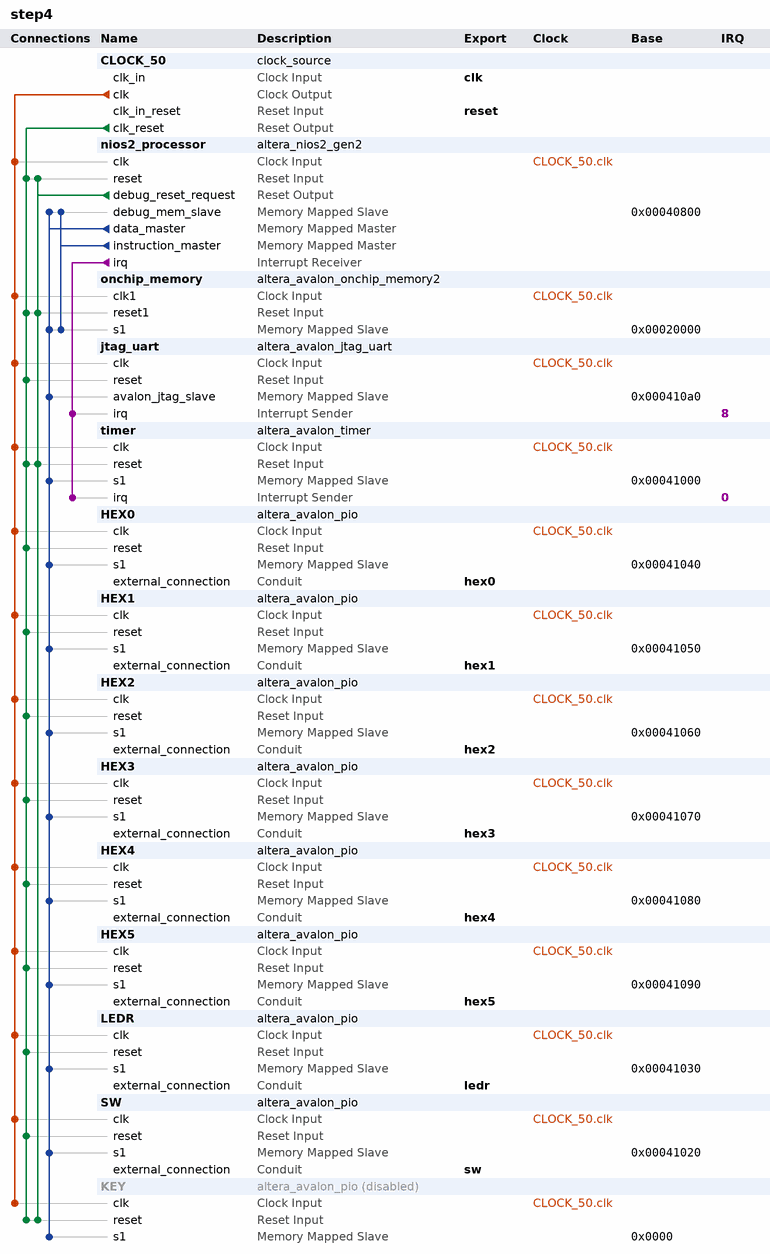
[diagram p0: system contents]
# Platform Designer (Qsys) system step4, Cyclone V 5CSEMA5F31C6
# Parameters at their usual value, and those the tool derives, are not listed.
package require -exact qsys 19.1
create_system step4
set_project_property DEVICE_FAMILY {Cyclone V}
set_project_property DEVICE 5CSEMA5F31C6

add_instance CLOCK_50 clock_source 19.1
set_instance_parameter_value CLOCK_50 clockFrequency 50000000

add_instance nios2_processor altera_nios2_gen2 19.1
set_instance_parameter_value nios2_processor dcache_size 2048
set_instance_parameter_value nios2_processor exceptionSlave onchip_memory.s1
set_instance_parameter_value nios2_processor icache_size 4096
set_instance_parameter_value nios2_processor impl Fast
set_instance_parameter_value nios2_processor resetSlave onchip_memory.s1

add_instance onchip_memory altera_avalon_onchip_memory2 19.1
set_instance_parameter_value onchip_memory dataWidth 32
set_instance_parameter_value onchip_memory dualPort false
set_instance_parameter_value onchip_memory initMemContent true
set_instance_parameter_value onchip_memory initializationFileName onchip_mem.hex
set_instance_parameter_value onchip_memory memorySize 128000

add_instance jtag_uart altera_avalon_jtag_uart 19.1
set_instance_parameter_value jtag_uart simInteractiveOptions NO_INTERACTIVE_WINDOWS

add_instance timer altera_avalon_timer 19.1
set_instance_parameter_value timer period 10
set_instance_parameter_value timer periodUnits MSEC

add_instance HEX0 altera_avalon_pio 19.1
set_instance_parameter_value HEX0 direction Output
set_instance_parameter_value HEX0 width 7

add_instance HEX1 altera_avalon_pio 19.1
set_instance_parameter_value HEX1 direction Output
set_instance_parameter_value HEX1 width 7

add_instance HEX2 altera_avalon_pio 19.1
set_instance_parameter_value HEX2 direction Output
set_instance_parameter_value HEX2 width 7

add_instance HEX3 altera_avalon_pio 19.1
set_instance_parameter_value HEX3 direction Output
set_instance_parameter_value HEX3 width 7

add_instance HEX4 altera_avalon_pio 19.1
set_instance_parameter_value HEX4 direction Output
set_instance_parameter_value HEX4 width 7

add_instance HEX5 altera_avalon_pio 19.1
set_instance_parameter_value HEX5 direction Output
set_instance_parameter_value HEX5 width 7

add_instance LEDR altera_avalon_pio 19.1
set_instance_parameter_value LEDR direction Output
set_instance_parameter_value LEDR width 10

add_instance SW altera_avalon_pio 19.1
set_instance_parameter_value SW direction Input
set_instance_parameter_value SW width 10

add_instance KEY altera_avalon_pio 19.1
set_instance_property KEY ENABLED false
set_instance_parameter_value KEY direction Output
set_instance_parameter_value KEY width 4

# connections
add_connection CLOCK_50.clk HEX0.clk clock
add_connection CLOCK_50.clk HEX1.clk clock
add_connection CLOCK_50.clk HEX2.clk clock
add_connection CLOCK_50.clk HEX3.clk clock
add_connection CLOCK_50.clk HEX4.clk clock
add_connection CLOCK_50.clk HEX5.clk clock
add_connection CLOCK_50.clk jtag_uart.clk clock
add_connection CLOCK_50.clk KEY.clk clock
add_connection CLOCK_50.clk LEDR.clk clock
add_connection CLOCK_50.clk nios2_processor.clk clock
add_connection CLOCK_50.clk onchip_memory.clk1 clock
add_connection CLOCK_50.clk SW.clk clock
add_connection CLOCK_50.clk timer.clk clock
add_connection CLOCK_50.clk_reset HEX0.reset reset
add_connection CLOCK_50.clk_reset HEX1.reset reset
add_connection CLOCK_50.clk_reset HEX2.reset reset
add_connection CLOCK_50.clk_reset HEX3.reset reset
add_connection CLOCK_50.clk_reset HEX4.reset reset
add_connection CLOCK_50.clk_reset HEX5.reset reset
add_connection CLOCK_50.clk_reset jtag_uart.reset reset
add_connection CLOCK_50.clk_reset KEY.reset reset
add_connection CLOCK_50.clk_reset LEDR.reset reset
add_connection CLOCK_50.clk_reset nios2_processor.reset reset
add_connection CLOCK_50.clk_reset onchip_memory.reset1 reset
add_connection CLOCK_50.clk_reset SW.reset reset
add_connection CLOCK_50.clk_reset timer.reset reset
add_connection nios2_processor.debug_reset_request KEY.reset reset
add_connection nios2_processor.debug_reset_request nios2_processor.reset reset
add_connection nios2_processor.debug_reset_request onchip_memory.reset1 reset
add_connection nios2_processor.debug_reset_request timer.reset reset
add_connection nios2_processor.data_master HEX0.s1 avalon
set_connection_parameter_value nios2_processor.data_master/HEX0.s1 baseAddress 0x00041040
add_connection nios2_processor.data_master HEX1.s1 avalon
set_connection_parameter_value nios2_processor.data_master/HEX1.s1 baseAddress 0x00041050
add_connection nios2_processor.data_master HEX2.s1 avalon
set_connection_parameter_value nios2_processor.data_master/HEX2.s1 baseAddress 0x00041060
add_connection nios2_processor.data_master HEX3.s1 avalon
set_connection_parameter_value nios2_processor.data_master/HEX3.s1 baseAddress 0x00041070
add_connection nios2_processor.data_master HEX4.s1 avalon
set_connection_parameter_value nios2_processor.data_master/HEX4.s1 baseAddress 0x00041080
add_connection nios2_processor.data_master HEX5.s1 avalon
set_connection_parameter_value nios2_processor.data_master/HEX5.s1 baseAddress 0x00041090
add_connection nios2_processor.data_master jtag_uart.avalon_jtag_slave avalon
set_connection_parameter_value nios2_processor.data_master/jtag_uart.avalon_jtag_slave baseAddress 0x000410a0
add_connection nios2_processor.data_master KEY.s1 avalon
set_connection_parameter_value nios2_processor.data_master/KEY.s1 baseAddress 0x0000
add_connection nios2_processor.data_master LEDR.s1 avalon
set_connection_parameter_value nios2_processor.data_master/LEDR.s1 baseAddress 0x00041030
add_connection nios2_processor.data_master nios2_processor.debug_mem_slave avalon
set_connection_parameter_value nios2_processor.data_master/nios2_processor.debug_mem_slave baseAddress 0x00040800
add_connection nios2_processor.data_master onchip_memory.s1 avalon
set_connection_parameter_value nios2_processor.data_master/onchip_memory.s1 baseAddress 0x00020000
add_connection nios2_processor.data_master SW.s1 avalon
set_connection_parameter_value nios2_processor.data_master/SW.s1 baseAddress 0x00041020
add_connection nios2_processor.data_master timer.s1 avalon
set_connection_parameter_value nios2_processor.data_master/timer.s1 baseAddress 0x00041000
add_connection nios2_processor.instruction_master nios2_processor.debug_mem_slave avalon
set_connection_parameter_value nios2_processor.instruction_master/nios2_processor.debug_mem_slave baseAddress 0x00040800
add_connection nios2_processor.instruction_master onchip_memory.s1 avalon
set_connection_parameter_value nios2_processor.instruction_master/onchip_memory.s1 baseAddress 0x00020000
add_connection nios2_processor.irq jtag_uart.irq interrupt
set_connection_parameter_value nios2_processor.irq/jtag_uart.irq irqNumber 8
add_connection nios2_processor.irq timer.irq interrupt
set_connection_parameter_value nios2_processor.irq/timer.irq irqNumber 0

# exported interfaces
add_interface clk clock sink
set_interface_property clk EXPORT_OF CLOCK_50.clk_in
add_interface hex0 conduit end
set_interface_property hex0 EXPORT_OF HEX0.external_connection
add_interface hex1 conduit end
set_interface_property hex1 EXPORT_OF HEX1.external_connection
add_interface hex2 conduit end
set_interface_property hex2 EXPORT_OF HEX2.external_connection
add_interface hex3 conduit end
set_interface_property hex3 EXPORT_OF HEX3.external_connection
add_interface hex4 conduit end
set_interface_property hex4 EXPORT_OF HEX4.external_connection
add_interface hex5 conduit end
set_interface_property hex5 EXPORT_OF HEX5.external_connection
add_interface ledr conduit end
set_interface_property ledr EXPORT_OF LEDR.external_connection
add_interface reset reset sink
set_interface_property reset EXPORT_OF CLOCK_50.clk_in_reset
add_interface sw conduit end
set_interface_property sw EXPORT_OF SW.external_connection

set_interconnect_requirement {$system} qsys_mm.clockCrossingAdapter HANDSHAKE
set_interconnect_requirement {$system} qsys_mm.enableEccProtection FALSE
set_interconnect_requirement {$system} qsys_mm.insertDefaultSlave FALSE
set_interconnect_requirement {$system} qsys_mm.maxAdditionalLatency 1

save_system step4.qsys
